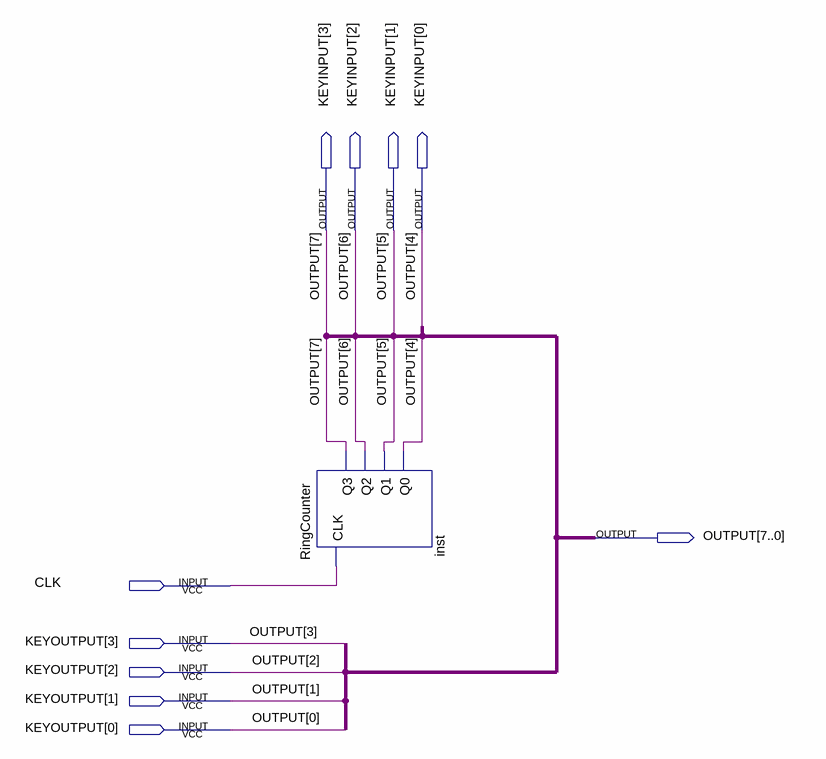
[diagram p0: schematic sheet]
// Quartus schematic Keyboard.bdf as structural Verilog: 1 symbols, 10 pins
module Keyboard (
  input  CLK,
  input  [3:0] KEYOUTPUT,
  output [3:0] KEYINPUT,
  output [7:0] OUTPUT
);

  RingCounter inst (.CLK(CLK), .Q3(KEYINPUT[3]), .Q2(KEYINPUT[2]), .Q1(KEYINPUT[1]), .Q0(KEYINPUT[0]));

  assign OUTPUT = {KEYINPUT, KEYOUTPUT};
endmodule
